# EasyEDA Pro project CogletESP_2026-02-24.epro, board Proto-Coglet
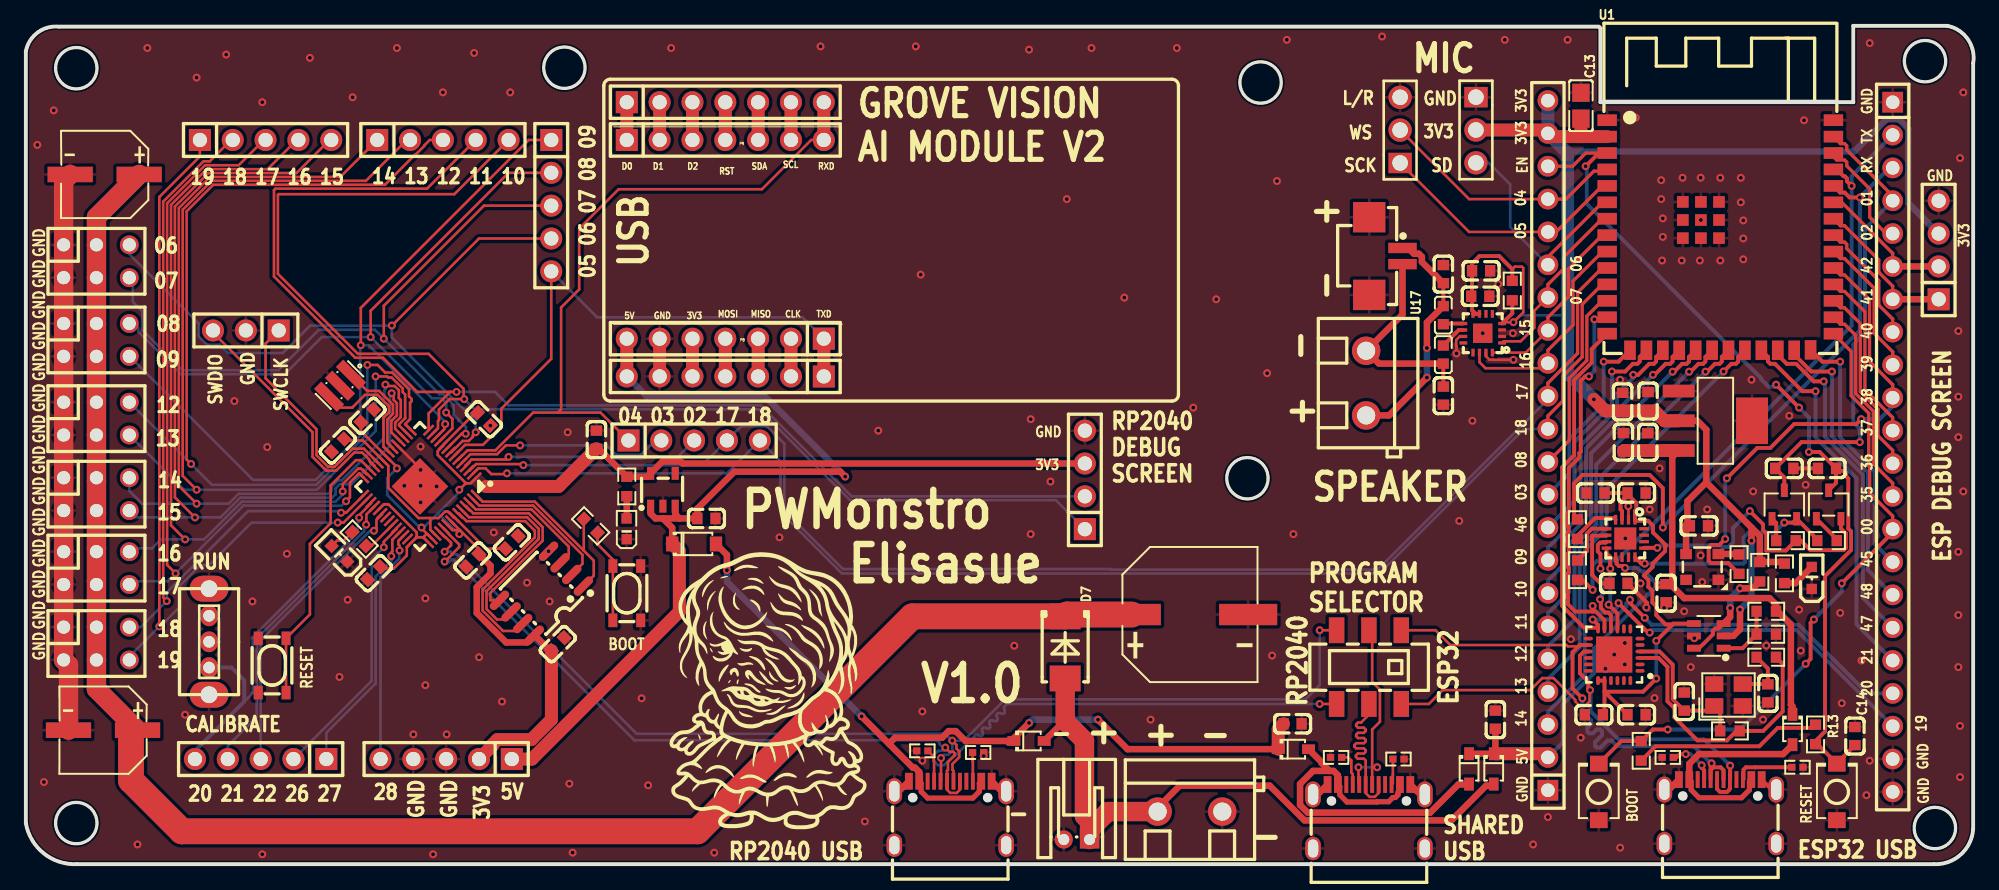
[diagram p5: board, top side]
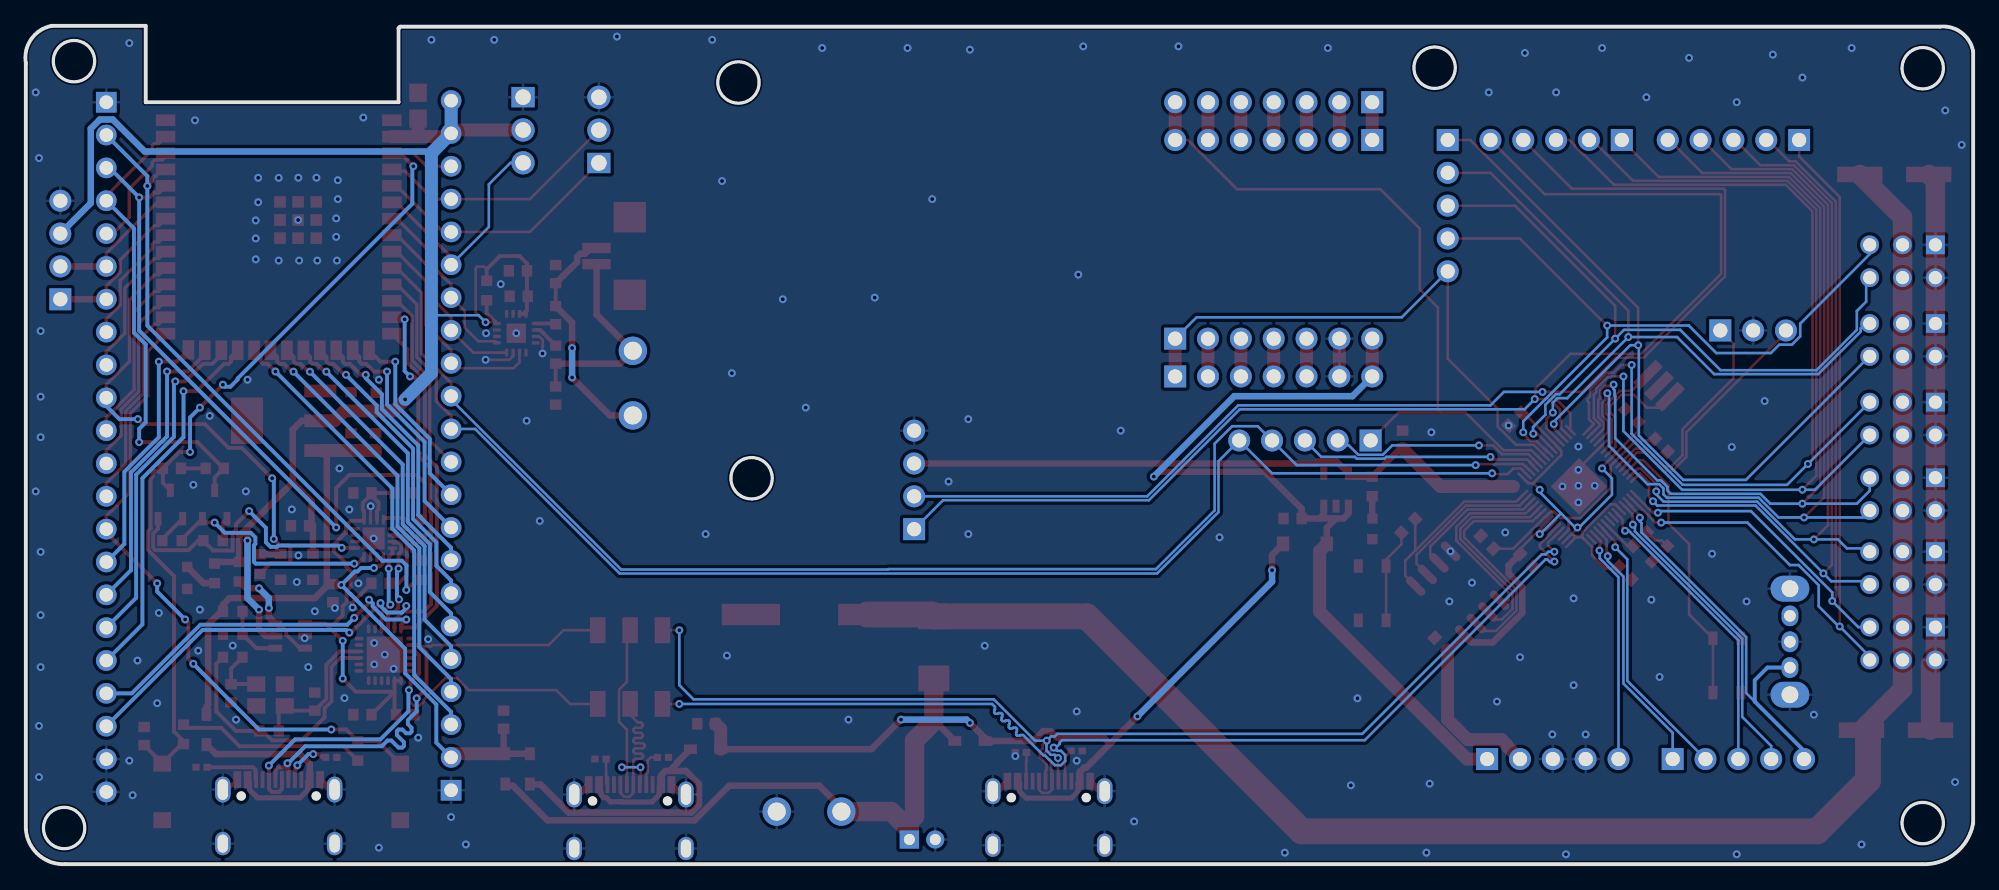
[diagram p6: board, bottom side, seen from below]

Outline 150.62 x 64.83 mm; copper layers: Top Layer, Bottom Layer. Coordinates in mm from the lower left corner of the outline.
Outline path: circle c3.9,61.56 r1.6 ; circle c3.9,3.17 r1.6 ; circle c41.66,61.59 r1.6 ; circle c94.49,29.84 r1.6 ; circle c95.5,60.45 r1.6 ; circle c146.9,62.1 r1.6 ; circle c147.66,2.79 r1.6 ; 0,62.86 0,3.17 arc(1.37,0.85) 3.94,0 147.57,0 arc(149.66,0.74) 150.62,2.72 150.62,61.94 arc(150.21,63.79) 148.62,64.83 141.35,64.83 141.35,58.93 121.79,58.93 121.79,64.64 121.67,64.77 2.58,64.77 arc(0.92,64.32) 0,62.86
Stack: Top Layer 0.035mm / Dielectric1 1.51mm FR4 er 4.5 / Bottom Layer 0.035mm

## Design rules (mm)
net USB_DM: DP1
net USB_DP: DP1
net D_N: DP3
net D_P: DP3
net DNIN: DP2
net DPIN: DP2
template: JLCPCB Capability(Two Layers Board)
spacing copperThickness1oz (default): track to track 0.102, other pairs 0.152 to 0.3
spacing copperThickness2oz: track to track 0.203, other pairs 0.152 to 0.3
track width copperThickness1oz (default): min 0.127, default 0.254, max 2.54
track width copperThickness2oz: min 0.203, default 0.254, max 2.54
differential pair differentialPair (default): width min 0.127, default 0.254, max 2.54; gap min 0.152, default 0.152
via viaSize (default): diameter min 0.5, default 0.61, max 10; hole min 0.3, default 0.305, max 6.3

## Placement (name value [footprint] x y rotation side)
C1  1uF  [C0603]  52.64 26.73 180 top
C2  10uF  [C0603]  113.67 11.18 270 top
C3  220uF  [CAP-SMD_BD6.3-L6.6-W6.6-FD]  5.97 10.36 180 top
C4  1uF  [C0603]  26.42 34.67 225 top
C5  1uF  [C0603]  24.13 32.38 45 top
C6  100nF  [C0603]  26.92 22.5 45 top
C7  100nF  [C0603]  34.54 23.49 45 top
C8  100nF  [C0603]  35.43 34.42 135 top
C9  100nF  [C0603]  37.59 24.89 225 top
C10  10uF  [C0603]  97.98 10.86 180 top
C11  1uF  [C0603]  44.13 32.83 270 top
C12  1uF  [C0603]  41.15 17.02 225 top
C13  10uF  [C0805]  120.28 58.66 270 top
C14  1uF  [C0603]  141.48 9.91 270 top
C15  1000uF  [CAP-SMD_BD10.0-L10.3-W10.3-FD]  90.04 19.3 0 top
C16  1uF  [C0603]  121.28 11.56 0 top
C17  1uF  [C0603]  124.59 11.56 180 top
C18  15pF  [C0603]  128.27 12.57 90 top
C19  15pF  [C0603]  134.75 13.21 270 top
C20  100nF  [C0603]  129.42 26.16 180 top
C21  220uF  [CAP-SMD_BD6.3-L6.6-W6.6-FD]  6.1 53.34 180 top
C22  100nF  [C0603]  124.59 28.7 0 top
C23  100nF  [C0603]  121.41 28.7 0 top
C24  100nF  [C0603]  123.19 21.72 180 top
C25  4.7uF  [C0603]  139.32 30.61 0 top
C26  1uF  [C0603]  136.02 30.61 180 top
C27  100nF  [C0603]  123.57 32.64 270 top
C30  100nF  [C0603]  123.51 35.75 270 top
C32  10uF  [C0603]  125.46 32.62 270 top
C33  10uF  [C0603]  125.48 35.81 270 top
C34  10uF  [C0603]  126.87 20.95 90 top
C35  10uF  [C0603]  112.5 43.92 180 top
C36  100nF  [C0603]  112.56 45.89 180 top
C37  220pF  [C0603]  109.64 36.23 90 top
C38  220pF  [C0603]  109.64 45.63 270 top
CN1  HC-1.25-2PWT  [CONN-SMD_2P-P1.25-HC-1.25-2PWT]  105.2 47.03 270 top
D1  DSK34  [SOD-123_L2.8-W1.8-LS3.7-RD]  51.69 24.76 0 top
D2  B5819WS  [SOD-323_L1.8-W1.3-LS2.5-RD]  113.54 7.37 270 top
D3  B5819WS  [SOD-323_L1.8-W1.3-LS2.5-RD]  136.65 10.41 270 top
D4  B5819WS  [SOD-323_L1.8-W1.3-LS2.5-RD]  98.04 8.89 0 top
D5  B5819WS  [SOD-323_L1.8-W1.3-LS2.5-RD]  111.63 7.37 270 top
D6  B5819WS  [SOD-323_L1.8-W1.3-LS2.5-RD]  77.6 9.53 0 top
D7  SS1045-SMB  [SMB_L4.4-W3.6-LS5.3-RD]  80.39 16.76 270 top
H1  PZ254V-11-05P  [HDR-TH_5P-P2.54-V-M]  32.51 8.13 180 top
H7  X6511WV-03H-C60D30  [HDR-TH_3P-P2.54-V-M]  17.02 41.27 180 top
H8  PZ254V-11-04P  [HDR-TH_4P-P2.54-V-M]  147.95 47.5 90 top
H9  PZ254V-11-04P  [HDR-TH_4P-P2.54-V-M]  81.92 29.72 90 top
H11  2.54-1*3P针  [HDR-TH_3P-P2.54-V-M-1]  106.3 56.77 90 top
H12  2.54-1*3P针  [HDR-TH_3P-P2.54-V-M-1]  112.16 56.78 270 top
H13  PZ254V-11-05P  [HDR-TH_5P-P2.54-V-M]  51.69 32.77 0 top
H14  PZ254V-11-05P  [HDR-TH_5P-P2.54-V-M]  40.64 50.93 270 top
H15  PZ254V-11-05P  [HDR-TH_5P-P2.54-V-M]  32.26 56.01 0 top
H16  PZ254V-11-05P  [HDR-TH_5P-P2.54-V-M]  18.54 56.01 0 top
H17  PZ254V-11-05P  [HDR-TH_5P-P2.54-V-M]  18.16 8.13 180 top
L1  BLM18PG121SN1D  [L0603]  109.64 42.46 270 top
L2  BLM18PG121SN1D  [L0603]  109.64 39.41 90 top
LED1  SML-D12P8WT86  [LED0603-RD_GREEN]  46.47 25.93 90 top
LED2  SML-D12D8WT86  [LED0603-R-RD_AMBER]  24.26 24 135 top
LED3  SML-D12D8WT86  [LED0603-R-RD_AMBER]  138.14 22.14 90 top
Q1  FDC6333C  [SOT-23-6_L2.9-W1.6-P0.95-LS2.8-BL]  130.18 17.65 90 top
Q2  S8050  [SOT-23-3_L3.0-W1.7-P0.95-LS2.9-BR]  136.02 27.81 270 top
Q3  S8050  [SOT-23-3_L3.0-W1.7-P0.95-LS2.9-BR]  139.45 27.81 270 top
R7  1kΩ  [R0603]  25.78 25.15 315 top
R8  1kΩ  [R0603]  46.48 29.21 90 top
R9  1kΩ  [R0603]  43.69 26.16 135 top
R11  5.1kΩ  [R0402]  69.34 8.76 0 top
R12  5.1kΩ  [R0402]  73.66 8.64 180 top
R13  10kΩ  [R0603]  138.43 10.03 90 top
R14  10kΩ  [R0603]  124.95 8.76 270 top
R15  100kΩ  [R0603]  134.62 19.56 180 top
R16  100kΩ  [R0603]  134.62 17.78 0 top
R17  100kΩ  [R0603]  134.12 22.61 270 top
R18  1kΩ  [R0603]  134.62 16 0 top
R19  1kΩ  [R0603]  131.81 10.3 180 top
R20  0Ω  [R0603]  132.52 23.2 90 top
R21  10kΩ  [R0603]  136.03 22.49 90 top
R22  0Ω  [R0603]  120.02 25.91 270 top
R23  0Ω  [R0603]  120.02 22.73 90 top
R24  12kΩ  [R0603]  139.32 25.02 180 top
R25  12kΩ  [R0603]  136.14 25.02 0 top
R26  5.1kΩ  [R0402]  127 8.25 0 top
R27  5.1kΩ  [R0402]  137.03 7.49 180 top
R28  1MΩ  [R0603]  114.98 44.36 90 top
R29  5.1kΩ  [R0402]  101.35 8.25 0 top
R30  5.1kΩ  [R0402]  106.17 8.13 180 top
SW1  SKRPACE010  [KEY-SMD_4P-L4.2-W3.2-P2.20-LS4.6]  46.48 20.95 90 top
SW2  SKRPACE010  [KEY-SMD_4P-L4.2-W3.2-P2.20-LS4.6]  19.05 15.37 270 top
SW3  TS-1088-AR02016  [SW-SMD_L3.9-W3.0-P4.45]  140.08 5.59 90 top
SW4  TS-1088-AR02016  [SW-SMD_L3.9-W3.0-P4.45]  121.67 5.59 90 top
SW5  MST22D18G2 125  [SW-SMD_MST22D18G2]  103.89 15.24 180 top
SW8  SS-12D02-VG4  [SW-TH_SS-12D02-VG4]  14.17 17.2 90 top
U1  ESP32-S3-WROOM-1-N16R8  [WIRELM-SMD_ESP32-S3-WROOM-1]  131.06 48.64 0 top
U2  HX PZ2.54-3x2P ZZ  [HDR-TH_6P-P2.54-V-M-R3-C2-S2.54_2]  5.46 40.54 270 top
U3  S2B-PH-K-S(LF)(SN)  [CONN-TH_S2B-PH-K-S-LF-SN]  81.28 1.91 0 top
U4  HX PZ2.54-3x2P ZZ  [HDR-TH_6P-P2.54-V-M-R3-C2-S2.54_2]  5.46 28.62 270 top
U5  HX PZ2.54-3x2P ZZ  [HDR-TH_6P-P2.54-V-M-R3-C2-S2.54_2]  5.46 34.46 270 top
U6  W25Q16JVSNIQ  [SOP-8_L4.9-W3.9-P1.27-LS6.0-BL]  39.88 20.95 135 top
U7  RP2040  [LQFN-56_L7.0-W7.0-P0.4-EP]  30.48 29.21 225 top
U8  MIC5504-3.3YM5-TR  [SOT-23-5_L3.0-W1.7-P0.95-LS2.8-TL]  49.28 28.96 90 top
U9  DS1021-1x22SF11-B  [HDR-TH_22P-P2.54-V-M]  144.4 32.26 270 top
U10  DS1021-1x22SF11-B  [HDR-TH_22P-P2.54-V-M]  117.73 32.38 90 top
U11  CH334F  [QFN-24_L4.0-W4.0-P0.50-BL-EP2.8]  122.86 16.2 90 top
U12  12MHz  [CRYSTAL-SMD_4P-L3.2-W2.5-BL]  131.7 13.08 0 top
U13  XL-3030RGBC-2812B  [LED-SMD_4P-L3.0-W3.0-P2.00-LS3.1_YKL-3030AY0203Z-001]  129.67 22.99 0 top
U14  CH343P  [TQFN-16_L3.0-W3.0-P0.50-BL-EP1.7]  123.72 25.19 180 top
U15  AMS1117-3.3  [SOT-223-4_L6.5-W3.5-P2.30-LS7.0-BR]  130.68 34.29 180 top
U16  MAX98357AETE+T  [TQFN-16_L3.0-W3.0-P0.50-BL-EP1.5]  112.69 41.06 90 top
U17  KF301-5.0-2P  [CONN-TH_P5.00_KF301-5.0-2P]  103.67 37.2 270 top
U18  HB-PH3-25417PB2GOP  [HDR-TH_7P-P2.54-V-M]  54.1 56.01 0 top
U19  HB-PH3-25417PB2GOP  [HDR-TH_7P-P2.54-V-M]  54.1 37.72 180 top
U20  HB-PH3-25417PB2GOP  [HDR-TH_7P-P2.54-V-M]  54.1 40.64 180 top
U21  HB-PH3-25417PB2GOP  [HDR-TH_7P-P2.54-V-M]  54.1 58.93 0 top
U22  HX PZ2.54-3x2P ZZ  [HDR-TH_6P-P2.54-V-M-R3-C2-S2.54_2]  5.46 46.63 270 top
U23  HX PZ2.54-3x2P ZZ  [HDR-TH_6P-P2.54-V-M-R3-C2-S2.54_2]  5.46 17.06 270 top
U24  HX PZ2.54-3x2P ZZ  [HDR-TH_6P-P2.54-V-M-R3-C2-S2.54_2]  5.46 22.9 270 top
U25  KF301-5.0-2P  [CONN-TH_P5.00_KF301-5.0-2P]  90.04 4.06 0 top
USBC1  TYPE-C-31-M-12  [USB-C_SMD-TYPE-C-31-M-12_1]  71.5 3.94 0 top
USBC2  TYPE-C-31-M-12  [USB-C_SMD-TYPE-C-31-M-12_1]  131.06 4.06 0 top
USBC3  TYPE-C-31-M-12  [USB-C_SMD-TYPE-C-31-M-12_1]  103.89 3.68 0 top
X1  12MHz  [CRYSTAL-SMD_3P-L3.2-W1.3-P1.2-BL]  24.3 37 225 top

## Footprints (pads in the part's own frame, mm; a bottom-side part is the same pattern mirrored in y, then rotated)
C0603
  rect 0.8x0.9 smd: 1(-0.7,0) 2(0.7,0)
C0805
  rect 1.41x1.35 smd: 1(-1,0) 2(1,0)
CAP-SMD_BD6.3-L6.6-W6.6-FD
  rect 3.5x1.2 smd: 1(-2.67,0) 2(2.67,0)
CAP-SMD_BD10.0-L10.3-W10.3-FD
  rect 4.5x1.65 smd: 1(-4.5,0) 2(4.5,0)
CONN-SMD_2P-P1.25-HC-1.25-2PWT
  rect 0.8x2.2 smd: 1(-0.625,1.285) 2(0.625,1.285)
  rect 2.35x2.5 smd: 3(-3.005,-1.285) 4(3.005,-1.285)
CONN-TH_P5.00_KF301-5.0-2P
  round 2.2 hole 1.4: 1(-2.5,0) 2(2.5,0)
CONN-TH_S2B-PH-K-S-LF-SN
  rect 1.5x1.4 hole 0.85: 1(1,0)
  round 1.4 hole 0.85: 2(-1,0)
CRYSTAL-SMD_3P-L3.2-W1.3-P1.2-BL
  rect 0.8x2.5 smd: 1(-1.2,0) 2(0,0) 3(1.2,0)
CRYSTAL-SMD_4P-L3.2-W2.5-BL
  rect 1.4x1.2 smd: 1(-1.1,-0.85) 2(1.1,-0.85) 3(1.1,0.85) 4(-1.1,0.85)
HDR-TH_3P-P2.54-V-M
  rect 1.7x1.7 hole 1.1: 1(-2.54,0)
  round 1.7 hole 1.1: 2(0,0) 3(2.54,0)
HDR-TH_3P-P2.54-V-M-1
  rect 1.575x1.8 hole 1.2: 1(-2.54,0)
  round 1.8 hole 1.2: 2(0,0) 3(2.54,0)
HDR-TH_4P-P2.54-V-M
  rect 1.7x1.7 hole 1.1: 1(-3.81,0)
  round 1.7 hole 1.1: 2(-1.27,0) 3(1.27,0) 4(3.81,0)
HDR-TH_5P-P2.54-V-M
  rect 1.7x1.7 hole 1.1: 1(-5.08,0)
  round 1.7 hole 1.1: 2(-2.54,0) 3(0,0) 4(2.54,0) 5(5.08,0)
HDR-TH_6P-P2.54-V-M-R3-C2-S2.54_2
  round 1.45 hole 1.02: 1(1.27,2.54) 2(-1.27,2.54) 3(-1.27,0) 4(1.27,0) 5(1.27,-2.54)
  rect 1.45x1.45 hole 1.02: 6(-1.27,-2.54)
HDR-TH_7P-P2.54-V-M
  rect 1.7x1.7 hole 1.1: 1(-7.62,0)
  round 1.7 hole 1.1: 2(-5.08,0) 3(-2.54,0) 4(0,0) 5(2.54,0) 6(5.08,0) 7(7.62,0)
HDR-TH_22P-P2.54-V-M
  rect 1.6x1.6 hole 1.05: 1(-26.67,0)
  round 1.6 hole 1.05: 2(-24.13,0) 3(-21.59,0) 4(-19.05,0) 5(-16.51,0) 6(-13.97,0) 7(-11.43,0) 8(-8.89,0) 9(-6.35,0) 10(-3.81,0) 11(-1.27,0) 12(1.27,0) 13(3.81,0) 14(6.35,0) 15(8.89,0) 16(11.43,0) 17(13.97,0) 18(16.51,0) 19(19.05,0) 20(21.59,0) 21(24.13,0) 22(26.67,0)
KEY-SMD_4P-L4.2-W3.2-P2.20-LS4.6
  rect 1.05x0.7 smd: 1(-2.1,1.075) 2(2.1,1.075) 3(-2.1,-1.075) 4(2.1,-1.075)
L0603
  rect 0.8x0.864 smd: 1(-0.7,0) 2(0.7,0)
LED0603-R-RD_AMBER
  rect 0.8x0.8 smd: 1(0.851,0) 2(-0.851,0)
LED0603-RD_GREEN
  rect 0.8x0.8 smd: 1(-0.799,-0.004) 2(0.799,0.004)
LED-SMD_4P-L3.0-W3.0-P2.00-LS3.1_YKL-3030AY0203Z-001
  rect 0.9x0.8 smd: 1(-1.25,1) 2(-1.25,-1) 3(1.25,-1) 4(1.25,1)
LQFN-56_L7.0-W7.0-P0.4-EP
  rect 1.1x0.2 smd: 1(-3.55,2.6) 2(-3.55,2.2) 3(-3.55,1.8) 4(-3.55,1.4) 5(-3.55,1) 6(-3.55,0.6) 7(-3.55,0.2) 8(-3.55,-0.2) 9(-3.55,-0.6) 10(-3.55,-1) 11(-3.55,-1.4) 12(-3.55,-1.8) 13(-3.55,-2.2) 14(-3.55,-2.6) 29(3.55,-2.6) 30(3.55,-2.2) 31(3.55,-1.8) 32(3.55,-1.4) 33(3.55,-1) 34(3.55,-0.6) 35(3.55,-0.2) 36(3.55,0.2) 37(3.55,0.6) 38(3.55,1) 39(3.55,1.4) 40(3.55,1.8) 41(3.55,2.2) 42(3.55,2.6)
  rect 0.2x1.1 smd: 15(-2.6,-3.55) 16(-2.2,-3.55) 17(-1.8,-3.55) 18(-1.4,-3.55) 19(-1,-3.55) 20(-0.6,-3.55) 21(-0.2,-3.55) 22(0.2,-3.55) 23(0.6,-3.55) 24(1,-3.55) 25(1.4,-3.55) 26(1.8,-3.55) 27(2.2,-3.55) 28(2.6,-3.55) 43(2.6,3.55) 44(2.2,3.55) 45(1.8,3.55) 46(1.4,3.55) 47(1,3.55) 48(0.6,3.55) 49(0.2,3.55) 50(-0.2,3.55) 51(-0.6,3.55) 52(-1,3.55) 53(-1.4,3.55) 54(-1.8,3.55) 55(-2.2,3.55) 56(-2.6,3.55)
  rect 3.1x3.1 smd: 57(0,0)
QFN-24_L4.0-W4.0-P0.50-BL-EP2.8
  oval 0.28x0.7 smd: 1(-1.25,-2) 2(-0.75,-2) 3(-0.25,-2) 4(0.25,-2) 5(0.75,-2) 6(1.25,-2) 13(1.25,2) 14(0.75,2) 15(0.25,2) 16(-0.25,2) 17(-0.75,2) 18(-1.25,2)
  oval 0.7x0.28 smd: 7(2,-1.25) 8(2,-0.75) 9(2,-0.25) 10(2,0.25) 11(2,0.75) 12(2,1.25) 19(-2,1.25) 20(-2,0.75) 21(-2,0.25) 22(-2,-0.25) 23(-2,-0.75) 24(-2,-1.25)
  rect 2.8x2.8 smd: 25(0.013,0)
R0402
  rect 0.566x0.54 smd: 1(-0.433,0) 2(0.433,0)
R0603
  rect 0.806x0.864 smd: 1(-0.753,0) 2(0.753,0)
SMB_L4.4-W3.6-LS5.3-RD
  rect 2x2.4 smd: 1(-2.4,0) 2(2.4,0)
SOD-123_L2.8-W1.8-LS3.7-RD
  rect 0.95x1.15 smd: 1(-1.692,0) 2(1.692,0)
SOD-323_L1.8-W1.3-LS2.5-RD
  rect 1x0.75 smd: 1(-1.173,0) 2(1.173,0)
SOP-8_L4.9-W3.9-P1.27-LS6.0-BL
  oval 0.63x1.865 smd: 1(-1.905,-2.683) 2(-0.635,-2.683) 3(0.635,-2.683) 4(1.905,-2.683) 5(1.905,2.683) 6(0.635,2.683) 7(-0.635,2.683) 8(-1.905,2.683)
SOT-23-3_L3.0-W1.7-P0.95-LS2.9-BR
  rect 1.038x0.532 smd: 1(1.101,-0.95) 2(1.101,0.95) 3(-1.101,0)
SOT-23-5_L3.0-W1.7-P0.95-LS2.8-TL
  rect 1x0.55 smd: 1(-1.272,0.95) 2(-1.272,0) 3(-1.272,-0.95) 4(1.272,-0.95) 5(1.272,0.95)
SOT-23-6_L2.9-W1.6-P0.95-LS2.8-BL
  rect 0.532x1.072 smd: 1(-0.95,-1.149) 2(0,-1.149) 3(0.95,-1.149) 4(0.95,1.149) 5(0,1.149) 6(-0.95,1.149)
SOT-223-4_L6.5-W3.5-P2.30-LS7.0-BR
  rect 2.47x0.98 smd: 1(2.835,-2.3) 2(2.835,0) 3(2.835,2.3)
  rect 2.47x3.6 smd: 4(-2.835,0)
SW-SMD_L3.9-W3.0-P4.45
  rect 1.23x1.36 smd: 1(-2.185,0) 2(2.185,0)
SW-SMD_MST22D18G2
  rect 1.2x2 smd: 1(-2.5,2.85) 2(0,2.85) 3(2.5,2.85) 4(-2.5,-2.85) 5(0,-2.85) 6(2.5,-2.85)
SW-TH_SS-12D02-VG4
  oval 1.6x1.3 hole 0.9: 1(-2,0) 2(-0.006,0) 3(2,0)
  oval 2x3 hole 1.3: 4(4.1,0) 5(-4.1,0)
TQFN-16_L3.0-W3.0-P0.50-BL-EP1.5
  rect 0.25x0.6 smd: 1(-0.749,-1.5) 2(-0.248,-1.5) 3(0.252,-1.5) 4(0.751,-1.5) 9(0.75,1.5) 10(0.25,1.5) 11(-0.25,1.5) 12(-0.749,1.5)
  rect 0.6x0.25 smd: 5(1.5,-0.748) 6(1.5,-0.248) 7(1.5,0.252) 8(1.5,0.752) 13(-1.5,0.752) 14(-1.5,0.252) 15(-1.5,-0.248) 16(-1.5,-0.748)
  rect 1.5x1.5 smd: 17(0,0)
TQFN-16_L3.0-W3.0-P0.50-BL-EP1.7
  rect 0.25x0.75 smd: 1(-0.749,-1.45) 2(-0.248,-1.45) 3(0.252,-1.45) 4(0.751,-1.45) 9(0.75,1.45) 10(0.25,1.45) 11(-0.25,1.45) 12(-0.749,1.45)
  rect 0.75x0.25 smd: 5(1.45,-0.75) 6(1.45,-0.25) 7(1.45,0.25) 8(1.45,0.75) 13(-1.45,0.75) 14(-1.45,0.25) 15(-1.45,-0.25) 16(-1.45,-0.75)
  rect 1.7x1.7 smd: 17(0.001,0)
USB-C_SMD-TYPE-C-31-M-12_1
  oval 1.2x2 hole 0.8x1.6: 1(4.325,1.706) 4(-4.325,1.706)
  oval 1.2x1.8 hole 0.8x1.4: 2(4.325,-2.474) 3(-4.325,-2.474)
  custom 0.6x1.3 smd: A1B12(-3.2,2.474) A4B9(-2.4,2.474) B1A12(3.2,2.474) B4A9(2.401,2.474)
  rect 0.3x1.3 smd: A5(-1.25,2.474) A6(-0.25,2.474) A7(0.25,2.474) A8(1.25,2.474) B5(1.75,2.474) B6(0.75,2.474) B7(-0.75,2.474) B8(-1.75,2.474)
WIRELM-SMD_ESP32-S3-WROOM-1
  rect 1.5x0.9 smd: 1(-8.75,8.895) 2(-8.75,7.625) 3(-8.75,6.355) 4(-8.75,5.085) 5(-8.75,3.815) 6(-8.75,2.545) 7(-8.75,1.275) 8(-8.75,0.005) 9(-8.75,-1.265) 10(-8.75,-2.535) 11(-8.75,-3.805) 12(-8.75,-5.075) 13(-8.75,-6.345) 14(-8.75,-7.615) 27(8.75,-7.615) 28(8.75,-6.345) 29(8.75,-5.075) 30(8.75,-3.805) 31(8.75,-2.535) 32(8.75,-1.265) 33(8.75,0.005) 34(8.75,1.275) 35(8.75,2.545) 36(8.75,3.815) 37(8.75,5.085) 38(8.75,6.355) 39(8.75,7.625) 40(8.75,8.895)
  rect 0.9x1.5 smd: 15(-6.985,-8.895) 16(-5.715,-8.895) 17(-4.445,-8.895) 18(-3.175,-8.895) 19(-1.905,-8.895) 20(-0.635,-8.895) 21(0.635,-8.895) 22(1.905,-8.895) 23(3.175,-8.895) 24(4.445,-8.895) 25(5.715,-8.895) 26(6.985,-8.865)
  rect 0.9x0.9 smd: 41(-2.9,2.575) 41(-2.9,1.175) 41(-2.9,-0.225) 41(-1.5,2.575) 41(-1.5,1.175) 41(-1.5,-0.225) 41(-0.1,2.575) 41(-0.1,1.175) 41(-0.1,-0.225)

## Nets
As in the schematic.

Pads without a net: SW8 3; U7 35 36 41; U8 4; U11 1 2 5 6 7 8 13 16 17 18 21 22 23 24; U13 2; U14 10 11 14 15 16; U16 5 6 12 13; USBC1 A8 B8; USBC2 A8 B8; USBC3 A8 B8

## Via types
v1: diameter 0.61, hole 0.305, Top Layer to Bottom Layer, 267 vias

## Routing (per net, layer and track width the routed paths; a pad name or vN(x,y) marks a point on that pad's centre or on a via; arc(x,y) is an arc through that point)
1V1: length 18.6
  Top Layer w0.2: 31.29,26.77 30.38,26.77 28.04,29.11 28.04,30.81 U7.23 26.08,32.77 24.87,32.77 ; 31.29,26.77 31.92,26.77 32.43,27.27 32.63,27.27 33.06,26.84 33.13,26.84 35.58,24.4 C9.2 ; 31.29,26.76 31.29,25.86 U7.45
3V3: length 117.3
  Top Layer w0.2: U7.44 31.05,25.53 ; 31.05,25.53 30.61,25.97 v1(30.61,26.03) ; 31.05,25.53 30.99,25.53 30.74,25.28 30.74,25.27 ; U7.48 33,25.84 33.57,25.84 ; U7.1 34.4,29.45 34.12,29.45 ; 33.57,25.84 33.53,25.79 v1(33.53,25.53) ; 33.57,25.84 U7.49 ; 33.57,25.84 35.04,24.37 C7.2 ; 30.74,25.27 31.15,24.86 ; 30.74,25.27 30.22,25.27 ; C6.2 27.56,22.86 28.45,22.86 29.46,23.88 29.46,24.52 U7.42 30.22,25.27 ; 34.12,29.45 34.02,29.45 v1(33.53,28.96) ; 34.12,29.45 34.11,29.46 34.04,29.46 31.85,31.65 31.85,31.93 32.28,32.36 U7.10 34.77,34.91 34.94,34.91 ; 30.22,25.27 30.22,25.34 30.24,25.36 30.24,25.57 30.22,25.58 30.22,25.66 28.07,27.81 27.99,27.81 27.97,27.84 27.76,27.84 27.74,27.81 27.67,27.81 U7.33 ; v1(28.7,30.61) 28.7,30.71 U7.22 25.92,33.49 C4.2
  Top Layer w0.5: H9.3 50.81,30.99 50.67,31.13 49.23,31.13 U8.5 48.06,29.96 R8.2 44.31,32.13 C11.2 ; 40.65,16.52 40.52,16.52 39.33,17.71 38.76,17.14 37.15,17.14 34.88,19.42 34.88,21.42 35.94,22.48 35.94,23.09 C7.2
  Top Layer w1: 40.65,16.52 40.65,11.19 39.09,9.63 36.47,9.63 36.09,9.25 36.09,9.17 H1.2 ; C11.2 41.21,29.21 35.56,29.21
  Bottom Layer w0.2: v1(33.53,28.96) 33.53,28.78 31.88,27.13 ; 31.88,27.13 30.78,26.03 v1(30.61,26.03) 30.48,26.03 27.94,28.57 27.94,29.84 v1(28.7,30.61) ; 31.88,27.13 33.49,25.53 v1(33.53,25.53)
3V3_OP: length 34.2
  Top Layer w0.3: 127.31,18.48 127.25,18.54 126.82,18.54 126.11,19.26 126.11,19.94 125.81,20.24 125.81,21.13 125.49,21.45 125.5,21.47 125.5,21.97 125.15,22.32 125.16,22.32 125.83,22.99 125.83,23.24 126.8,24.21 126.8,24.62 126.85,24.66 125.86,25.65 125.86,26.18 125.48,26.55 124.55,26.55 U14.1 124.46,27.31 124.57,27.41 124.57,27.83 124.56,27.84 124.56,27.94 124.08,28.42 123.98,28.42 123.92,28.37 ; 127.31,18.48 127.44,18.6 Q1.4 ; 127.31,18.48 v1(126.11,17.27) ; U11.19 U11.20 122.11,13.34 ; 123.89,28.46 123.39,28.04 123.39,27.98 123.34,27.94 123.34,27.43 123.46,27.32 U14.3 ; 122.11,13.34 122.11,11.68 C16.2 ; 122.11,13.34 125.1,13.34 v1(126.11,14.35) ; 122.11,13.34 C17.2 ; 122.11,28.7 C22.1
  Bottom Layer w0.3: v1(126.11,14.35) v1(126.11,17.27)
GND: length 67.3
  Top Layer w0.2: U14.2 123.96,27.67 v1(123.95,27.69) ; v1(115.06,39) 113.49,39 113.49,39.01 113.21,39.01 112.94,39.28 U16.15 ; U16.11 110.91,40.81 110.64,40.54 110.64,40.08 110.66,40.06 v1(110.66,39.5) ; U7.19 30.53,30.57 v1(30.53,30.49)
  Top Layer w0.3: v1(125.34,19.85) 125.34,20.13 125.41,20.2 C24.1 ; USBC2.B1A12 135.03,5.77 USBC2.1 ; C26.1 C25.1
  Top Layer w0.5: USBC2.A1B12 127.1,5.77 USBC2.4 ; USBC3.4 99.92,5.39 100.69,6.16 ; USBC1.A1B12 67.53,5.64 USBC1.4 ; USBC3.1 107.85,5.39 USBC3.B1A12 ; USBC1.B1A12 75.47,5.64 USBC1.1
  Top Layer w1: U19.6 U20.6
  Top Layer w1.5: C21.2 2.92,52.83 U22.6 U22.5 U2.6 U2.5 U5.6 U5.5 U23.6 U23.5 3.3,15.41 C3.2
  vias: v1(0.89,55.63) v1(1.4,6.35) v1(2.16,58.29) v1(8.64,1.52) v1(9.4,63.12) v1(12.32,11.56) v1(13.21,60.83) v1(15.49,62.61) v1(16.13,35.81) v1(17.53,20.32) v1(18.29,58.93) v1(18.29,0.76) v1(18.67,32.26) v1(20.19,24) v1(21.97,62.36) v1(24.26,14.48) v1(24.89,20.45) v1(25.27,59.31) v1(28.7,63.12) v1(29.27,29.26) v1(29.97,10.03) v1(30.53,32.29) v1(30.53,29.26) v1(30.53,27.98) v1(30.9,20.56) v1(30.9,13.84) v1(31.5,0.76) v1(31.77,29.21) v1(32.26,59.69) v1(32.55,10.03) v1(34.67,62.74) v1(35.05,16) v1(35.93,33.92) v1(36.19,25.65) v1(36.83,12.57) v1(37.46,59.69) v1(38.77,21.77) v1(40.43,24.2) v1(40.51,20.32) v1(41.91,33.4) v1(42.04,6.22) v1(42.29,0.89) v1(47.62,12.83) v1(48.13,6.1) v1(49.91,63.12) v1(53.24,0.89) v1(58.29,25.27) v1(61.47,63.25) v1(64.9,3.3) v1(65.93,33.53) v1(68.83,63.25) v1(69.21,45.59) v1(69.34,11.81) v1(69.34,8) v1(74.09,8.36) v1(76.45,16.89) v1(77.6,62.99) v1(77.72,34.41) v1(77.72,25.53) v1(79.25,29.59) v1(80.52,51.43) v1(82.42,63.12) v1(84.96,43.81) v1(86.99,11.18) v1(89.03,63.12) v1(90.3,35.31) v1(92.08,43.69) v1(96.01,37.97) v1(96.39,16.13) v1(96.77,52.83) v1(97.54,63.75) v1(98.04,25.53) v1(104.9,64.01) v1(110.87,26.54) v1(111.89,34.29) v1(112.69,41.06) v1(113.89,44.86) v1(114.39,63.75) v1(115.03,41.06) v1(116.59,1.52) v1(117.73,3.64) v1(119.25,63.75) v1(119.51,17.4) v1(120.27,9.78) v1(122.17,15.11) v1(122.86,16.21) v1(123.32,37.46) v1(123.32,1.27) v1(123.72,25.19) v1(123.68,17.1) v1(123.68,15.45) v1(124.52,57.74) v1(124.9,21.72) v1(125.6,27.43) v1(125.98,12.84) v1(126.36,30.61) v1(126.49,52.9) v1(126.49,51.43) v1(126.62,49.94) v1(126.62,48.51) v1(126.56,46.68) v1(126.72,19.81) v1(128.14,53.09) v1(128.08,46.68) v1(128.27,19.56) v1(128.78,15.24) v1(129.06,17.48) v1(129.55,53.09) v1(129.48,46.68) v1(129.54,23.88) v1(129.56,49.82) v1(129.66,21.82) v1(130.05,27.43) v1(131.06,53.08) v1(131.06,46.68) v1(132.65,53.08) v1(132.65,51.19) v1(132.84,49.78) v1(132.84,48.39) v1(132.84,46.78) v1(133.48,37.46) v1(133.6,28.83) v1(134.37,11.18) v1(134.62,16.9) v1(136.4,34.67) v1(137.16,19.68) v1(137.29,16.51) v1(137.54,57.53) v1(137.67,29.34) v1(140.33,19.43) v1(140.46,12.45) v1(141.99,15.75) v1(142.37,5.33) v1(142.62,63.5) v1(142.62,8) v1(149.48,41.23) v1(149.48,36.15) v1(149.48,33.02) v1(149.48,24.15) v1(149.48,19.26) v1(149.48,15.24) v1(149.61,54.61) v1(149.61,10.69) v1(149.61,6.73) v1(149.86,59.69) v1(149.86,28.83)
VBUS: length 66.4
  Top Layer w0.4: USBC1.A4B9 69.25,6.26 69.25,5.62 69.76,5.11 73.24,5.11 73.75,5.62 73.75,6.26 USBC1.B4A9
  Top Layer w0.5: 66.76,9.31 68.61,7.46 68.77,7.46 69.1,7.13 USBC1.A4B9 ; 66.76,9.31 v1(64.64,11.43) ; 66.76,9.31 67.23,9.78 70.87,9.78 71.37,10.29 71.92,10.29 72.68,9.53 75.89,9.53 75.99,9.42 76.32,9.42 D6.1 76.42,9.75 v1(77.6,10.92) ; D1.2 54.23,23.92 v1(54.23,22.73) ; D4.1 85.22,8.89 v1(82.93,11.18)
  Top Layer w1: C10.2 96.87,10.45 D4.1
  Bottom Layer w0.5: v1(77.6,10.92) 77.85,11.18 v1(82.93,11.18) ; v1(64.64,11.43) 54.23,21.84 v1(54.23,22.73)
VBUSINESP: length 62.8
  Top Layer w0.3: U14.9 122.97,23.59 123.04,23.52 123.04,23.24 123.22,23.06 123.54,23.06 v1(123.7,22.91)
  Top Layer w0.5: U15.3 127.35,31.49 127.35,21.5 128.27,20.57 134.87,20.57 135.37,20.07 135.37,19.68 136.52,18.53 136.52,12.32 136.65,12.19 D3.1 ; D5.1 113.41,8.54 113.54,8.41 113.67,8.54 C2.2 ; v1(126.22,21.59) 126.81,21.59 126.87,21.65
  Top Layer w1: U10.2 117.45,8.54 113.67,8.54 ; C27.2 123.62,31.99 U15.3
  Bottom Layer w0.3: U10.2 118.87,9.4 118.87,12.35 121.28,14.76 121.28,16.67 125.48,20.86 125.49,20.86 v1(126.22,21.59) 125.18,22.63 124.97,22.63 124.7,22.91 v1(123.7,22.91)
#EN: length 68.1
  Top Layer w0.254: 121.67,55 120.65,55 119.63,53.97 U10.20
  Top Layer w0.3: 138.44,9.28 138.44,9.53 139.16,10.26 139.16,22.28 141.18,24.3 141.18,25.74 140.97,25.96 140.97,29.82 140.81,29.98 140.81,30.28 140.67,30.41 140.02,30.41 140.02,29.49 Q3.3 ; 138.44,9.28 138.57,9.28 SW3.2 140.08,7.81 C14.2 ; 138.44,9.28 R13.1 ; U1.3 121.67,55 v1(120.65,53.97) ; C25.2 138.75,31.88 v1(137.92,31.88) ; v1(137.16,35.31) v1(135.38,37.08)
  Bottom Layer w0.3: v1(135.38,37.08) 135.22,36.92 134.8,36.92 134.24,37.48 134.24,37.56 120.73,51.07 120.73,53.89 v1(120.65,53.97) ; v1(137.16,35.31) 137.92,34.54 v1(137.92,31.88)
D_N: length 38.5
  Top Layer w0.2: SW5.4 109.04,18.09 110.18,16.95 119.17,16.95 119.28,16.84 120.09,16.84
  Top Layer w0.3: v1(120.4,12.83) 119.63,13.59 119.63,16.38 120.2,16.95 U11.14 ; v1(130.39,7.8) 130.31,7.73 130.31,7.26 ; USBC2.A7 131.31,7.27 131.09,7.49 130.54,7.49 130.31,7.26 ; USBC2.B7 130.31,7.26
  Bottom Layer w0.3: v1(130.39,7.8) 130.33,7.8 129.01,9.12 123.09,9.12 122.65,9.56 122.35,9.56 121.8,9.02 121.5,9.02 121.38,9.14 121.38,9.44 121.92,9.98 121.92,10.28 121.8,10.41 121.5,10.41 121.21,10.12 120.91,10.12 120.79,10.24 120.79,10.54 121.07,10.83 121.07,11.13 120.4,11.81 v1(120.4,12.83)
D_P: length 38.4
  Top Layer w0.2: SW5.1 108.53,12.39 109.6,13.46 116.37,13.46 117.29,14.39 118.17,14.39 119.84,12.71 119.84,12.6 120.17,12.27 120.63,12.27 120.95,12.6 120.95,13.42 v1(120.99,13.46)
  Top Layer w0.3: v1(131.83,7.62) 131.83,6.55 USBC2.B6 ; U11.15 120.52,16.45 120.21,16.13 120.21,14.76 120.86,14.11 120.86,13.6 v1(120.99,13.46) ; 131.83,5.84 131.77,5.78 131.77,5.76 131.59,5.59 131.04,5.59 130.81,5.81 USBC2.A6
  Bottom Layer w0.3: v1(131.83,7.62) 129.79,9.65 123.2,9.65 121.03,11.82 121.03,13.42 v1(120.99,13.46)
DNIN: length 15.7
  Top Layer w0.2: 104.14,7.51 104.16,7.49 v1(104.52,7.49) ; 104.14,7.51 USBC3.A7 ; 104.14,7.51 104.14,10.41 104.74,11.01 104.74,13.49 104.14,14.1 104.14,17.59 103.89,17.84 SW5.5 ; USBC3.B7 103.08,6.21 v1(103.08,7.49)
  Bottom Layer w0.2: v1(103.08,7.49) v1(104.52,7.49)
DPIN: length 13.7
  Top Layer w0.2: SW5.2 103.89,11.56 103.28,10.95 103.04,10.95 102.9,10.81 102.9,10.69 103.04,10.55 103.49,10.55 103.64,10.41 103.64,10.29 103.49,10.15 103.04,10.15 102.9,10.01 102.9,9.89 103.04,9.75 103.49,9.75 103.64,9.61 103.64,9.49 103.49,9.35 102.9,9.35 102.76,9.21 102.76,9.09 102.9,8.95 103.49,8.95 103.64,8.81 103.64,8.69 103.49,8.55 103.02,8.55 102.88,8.41 102.88,8.29 103.02,8.15 103.49,8.15 103.64,8.01 USBC3.A6 103.64,5.5 103.93,5.21 104.34,5.21 104.65,5.51 104.65,6.14 USBC3.B6
DTR: length 17.8
  Top Layer w0.3: v1(136.02,26.42) 136.67,26.42 Q2.2 138.57,25.11 R24.2 ; v1(125.22,23.24) 124.96,23.24 U14.12
  Bottom Layer w0.3: v1(125.22,23.24) 132.84,23.24 132.98,23.37 132.98,24.66 132.87,24.77 132.87,25.27 133.23,25.63 135.23,25.63 v1(136.02,26.42)
EIO0: length 49.4
  Top Layer w0.254: U9.14 144.4,26.92 142.62,28.7 142.62,30.74 142.54,30.81 142.54,34.87 141.18,36.23 141.18,39.66 U1.27
  Top Layer w0.3: SW4.2 123.41,9.52 R14.1 125.85,10.41 v1(127,10.41) ; v1(140.46,21.72) 144.4,25.65 U9.14 ; v1(137.67,15.49) 138.05,15.87 138.05,18.67 v1(138.3,18.92)
  Bottom Layer w0.3: v1(138.3,18.92) 140.46,21.08 v1(140.46,21.72) ; v1(127,10.41) 132.59,10.41 v1(137.67,15.49)
EIO1: length 36.6
  Top Layer w0.254: U1.39 140.36,55.72 140.68,55.72 140.84,55.56 140.84,55.24 144.4,51.68 U9.4
  Top Layer w0.3: v1(141.86,32.64) 137.35,32.64 C26.2 136.02,29.91 Q2.3
  Bottom Layer w0.3: U9.4 142.26,49.17 142.26,41.11 141.35,40.2 141.35,34.17 141.86,33.66 v1(141.86,32.64)
EIO2: length 8.8
  Top Layer w0.254: U1.38 139.81,54.71 140.07,54.45 140.68,54.45 140.84,54.29 140.84,54 142.62,52.23 142.62,50.04 143.89,48.77 U9.5
EIO3: length 14.5
  Top Layer w0.3: U1.15 123.2,38.86 v1(122.05,38.86)
  Bottom Layer w0.3: v1(122.05,38.86) 122.05,35.56 119.38,32.89 119.38,30.23 U10.10
EIO4: length 19.2
  Top Layer w0.2: H11.2 111.63,51.43 U10.19
  Top Layer w0.254: U10.19 119.13,51.43 121.28,53.59 122.18,53.59 U1.4
EIO5: length 19.7
  Top Layer w0.2: U10.18 111.63,48.89 106.3,54.23
  Top Layer w0.254: U10.18 118.36,48.89 121.79,52.32 122.18,52.32 U1.5
EIO6: length 17.7
  Top Layer w0.254: U10.17 117.73,46.96 121.95,51.19 U1.6
  Bottom Layer w0.2: H12.3 113.15,54.24 114.81,52.58 114.81,49.28 U10.17
EIO7: length 14
  Top Layer w0.2: U10.16 117.69,43.81 116.68,42.8 116.68,41.49 115.62,40.43 114.31,40.43 U16.1
  Top Layer w0.254: U10.16 117.73,44.83 118.96,46.06 118.96,46.95 121.92,49.92 U1.7
EIO8: length 14.6
  Top Layer w0.254: U10.11 119.38,32.77 119.38,37.59 120.74,38.95 120.74,42.38 121.92,43.56 122.31,43.56 U1.12
EIO9: length 20.4
  Top Layer w0.3: v1(124.33,37.85) 124.72,37.85 125.57,38.69 125.92,38.69 126.1,38.87 126.1,39.23 U1.17
  Bottom Layer w0.3: v1(124.33,37.85) 124.33,37.59 123.08,36.34 123.08,35.2 120.27,32.38 120.27,27.02 117.73,24.48 U10.8
EIO10: length 23.3
  Top Layer w0.3: U1.18 127.37,39.23 127.37,38.87 127.19,38.69 126.84,38.69 125.99,37.85 v1(125.86,37.85)
  Bottom Layer w0.3: U10.7 117.73,21.94 118.87,23.08 118.87,24.89 120.67,26.69 120.67,32.15 123.49,34.97 123.49,35.47 v1(125.86,37.85)
EIO11: length 26.3
  Top Layer w0.3: U1.19 128.64,39.23 128.64,38.87 128.46,38.69 128.11,38.69 127.5,38.09 v1(127.38,38.09)
  Bottom Layer w0.3: v1(127.38,38.09) 121.07,31.78 121.07,26.46 119.38,24.76 119.38,21.05 117.73,19.4 U10.6
EIO12: length 29.4
  Top Layer w0.3: U1.20 129.91,39.23 129.91,38.87 129.73,38.69 129.38,38.69 128.77,38.09 v1(128.65,38.09)
  Bottom Layer w0.3: v1(128.65,38.09) 121.48,30.91 121.48,26.29 119.78,24.6 119.78,18.91 117.73,16.86 U10.5
EIO13: length 32.5
  Top Layer w0.3: v1(129.92,38.09) 130.04,38.09 130.65,38.69 131,38.69 131.18,38.87 131.18,39.23 U1.21
  Bottom Layer w0.3: U10.4 117.73,14.32 120.18,16.77 120.18,24.43 121.88,26.12 121.88,30.04 v1(129.92,38.09)
EIO14: length 35.5
  Top Layer w0.3: U1.22 132.45,39.23 132.45,38.87 132.27,38.69 131.92,38.69 131.32,38.1 v1(131.32,38.1)
  Bottom Layer w0.3: U10.3 117.73,11.78 120.59,14.63 120.59,24.27 122.28,25.96 122.28,29.06 v1(131.32,38.1)
EIO15: length 14.5
  Top Layer w0.2: U10.15 116.02,39.56 U16.16
  Top Layer w0.254: U10.15 117.73,42.29 119.31,43.87 119.31,46.04 121.79,48.51 122.18,48.51 U1.8
EIO16: length 17.1
  Top Layer w0.2: U16.14 112.44,38.82 112.9,38.35 117.35,38.35 U10.14
  Top Layer w0.254: U10.14 117.73,39.75 119.67,41.69 119.67,45.09 121.95,47.38 U1.9
EIO17: length 110.3
  Top Layer w0.2: v1(38.48,30.86) 38.4,30.94 34.82,30.94 34.33,30.45 U7.3
  Top Layer w0.254: U10.13 117.73,37.21 120.03,39.51 120.03,44.21 121.92,46.11 U1.10
  Bottom Layer w0.2: v1(38.48,30.86) 52.32,30.86 H13.4 55.33,33.87 57.32,33.87 58.67,32.51 58.67,27.35 63.21,22.82 83.9,22.82 83.93,22.78 104.57,22.78 117.73,35.94 U10.13
EIO18: length 109.1
  Top Layer w0.2: U7.2 34.99,30.61 35.56,30.61 36,30.16 37.15,30.16 v1(37.21,30.23)
  Top Layer w0.254: U1.11 121.92,44.84 120.38,43.29 120.38,39.23 118.87,37.72 118.87,35.81 117.73,34.67 U10.12
  Bottom Layer w0.2: v1(37.21,30.23) 54.23,30.23 H13.5 58.37,31.16 58.37,27.23 63.12,22.48 104.69,22.48 115.87,33.65 U10.12
EIO19: length 56.8
  Top Layer w0.3: v1(120.9,37.72) 120.61,37.72 120.27,37.38 120.27,31.9 120.16,31.79 120.16,31.45 119.34,30.64 119.34,27.25 119.28,27.19 119.28,26.13 119.34,26.07 119.34,25.75 119.28,25.68 119.28,24.63 119.34,24.56 119.34,24.08 119.28,24.01 119.28,22.96 119.34,22.9 119.34,22.57 119.28,22.51 119.28,20.1 119.84,19.53 121.43,19.53 122.11,18.86 U11.11 ; U1.13 122.15,42.14 v1(121.32,42.14) ; v1(123.19,20.19) 125.48,17.91 v1(125.6,17.91) ; 121.19,19.53 v1(121.19,19.97)
  Bottom Layer w0.3: v1(123.19,20.19) 123.29,20.1 123.29,20.07 122.68,19.46 121.54,19.46 121.19,19.81 v1(121.19,19.97) ; U9.20 136.95,18.11 125.81,18.11 v1(125.6,17.91) ; v1(121.32,42.14) 121.32,38.14 v1(120.9,37.72)
EIO20: length 54
  Top Layer w0.3: 121.61,18.22 121.61,18.5 v1(121.19,18.92) ; 121.61,18.22 121.54,18.29 120.52,18.29 118.83,19.98 118.83,30.69 119.76,31.62 119.76,37.43 121.12,38.79 121.12,39.83 U1.14 ; 121.61,18.22 U11.12 ; v1(124.08,20.45) 124.08,20.19 v1(125.22,19.05)
  Bottom Layer w0.3: v1(124.08,20.45) 123.8,20.16 123.8,19.94 122.77,18.92 v1(121.19,18.92) ; U9.19 142.43,13.21 137.12,18.51 125.76,18.51 v1(125.22,19.05)
EIO21: length 29
  Top Layer w0.3: U1.23 134.76,39.23 134.76,38.87 134.93,38.69 135.29,38.69 137.41,36.58 v1(138.43,36.58)
  Bottom Layer w0.3: v1(138.43,36.58) 138.43,33.02 141.61,29.84 141.61,18.54 U9.18
EIO35: length 15.9
  Top Layer w0.254: U1.28 140.36,41.75 140.68,41.75 141.54,40.89 141.54,36.39 142.9,35.03 142.9,30.96 144.4,29.46 U9.13
EIO36: length 14.7
  Top Layer w0.254: U1.29 140.36,43.02 140.68,43.02 141.9,41.81 141.9,36.54 143.26,35.18 143.26,33.14 144.4,32 U9.12
EIO37: length 13.4
  Top Layer w0.254: U1.30 140.36,44.29 140.68,44.29 142.25,42.72 142.25,36.69 144.4,34.54 U9.11
EIO38: length 38
  Top Layer w0.254: U1.31 140.36,45.56 140.68,45.56 142.61,43.64 142.61,38.87 144.4,37.08 U9.10
  Top Layer w0.3: v1(131.57,29.84) 133.92,32.19 134.93,32.19 136.78,34.04 141.58,34.04 v1(141.96,34.42) ; v1(131.44,25.15) 130.99,24.69 130.34,24.69 130.17,24.51 130.17,23.46 130.34,23.28 131.68,23.28 R20.1
  Bottom Layer w0.3: v1(141.96,34.42) 143.38,34.42 144.4,35.43 U9.10 ; v1(131.57,29.84) 131.44,29.72 v1(131.44,25.15)
EIO39: length 10.9
  Top Layer w0.254: U1.32 140.36,46.83 140.68,46.83 142.96,44.55 142.96,41.06 144.4,39.62 U9.9
EIO40: length 9.6
  Top Layer w0.254: U1.33 140.36,48.1 140.68,48.1 140.84,47.94 140.84,47.62 143.32,45.14 143.32,43.24 144.4,42.16 U9.8
EIO41: length 11.9
  Top Layer w0.254: U1.34 140.36,49.37 140.68,49.37 143.32,46.73 143.32,45.78 144.4,44.7 U9.7
  Top Layer w0.5: U9.7 H8.1
EIO42: length 10.8
  Top Layer w0.254: U9.6 144.4,47.24 140.45,51.19 U1.35
  Top Layer w0.5: U9.6 H8.2
EIO45: length 19.8
  Top Layer w0.3: U1.26 138.96,38.86 v1(140.33,38.86)
  Bottom Layer w0.3: v1(140.33,38.86) 140.33,33.01 143,30.35 143,24.76 U9.15
EIO46: length 17.7
  Top Layer w0.3: v1(122.68,38.1) 123.7,38.1 124.3,38.69 124.65,38.69 124.83,38.87 124.83,39.23 U1.16
  Bottom Layer w0.3: U10.9 119.78,28.09 119.78,32.66 122.68,35.56 v1(122.68,38.1)
EIO47: length 26
  Top Layer w0.3: U1.24 135.51,39.39 136.2,38.69 136.94,38.69 138.29,37.34 v1(139.06,37.34)
  Bottom Layer w0.3: v1(139.06,37.34) 139.17,37.23 139.17,33.04 142.09,30.12 142.09,20.59 U9.17
EIO48: length 23
  Top Layer w0.3: v1(139.7,38.1) 138.1,38.1 136.78,39.42 U1.25
  Bottom Layer w0.3: v1(139.7,38.1) 139.7,33.08 142.49,30.29 142.49,22.73 U9.16
EIORX: length 51.2
  Top Layer w0.3: U1.36 140.33,51.94 140.69,51.94 141.06,51.56 v1(141.86,51.56) ; R22.1 119.76,26.92 119.76,29.46 120.4,30.1 125.6,30.1 126.62,29.08 v1(126.62,26.03)
  Bottom Layer w0.3: U9.3 144.14,53.85 v1(141.86,51.56) 141.86,41.27 v1(126.62,26.03)
EIOTX: length 49.2
  Top Layer w0.3: U1.37 140.08,53.73 140.59,53.21 140.69,53.21 140.87,53.03 140.87,52.81 v1(141.22,52.45) ; v1(121.19,21.21) 120.42,21.98 R23.1
  Bottom Layer w0.3: U9.2 141.22,53.21 v1(141.22,52.45) 141.22,41.66 123.03,23.47 121.54,23.47 121.19,23.11 121.19,21.21 v1(121.19,21.21)
ESP3V3: length 14.6
  Top Layer w0.3: R13.2 138.18,10.54 135.51,10.54 134.08,9.12 126.06,9.12 R14.2
GPIO2: length 18.7
  Top Layer w0.2: v1(37.34,31.5) 37.14,31.3 34.48,31.3 33.98,30.8 U7.4
  Bottom Layer w0.2: v1(37.34,31.5) 45.4,31.5 45.53,31.36 47.69,31.36 47.82,31.5 50.42,31.5 H13.3
GPIO3: length 16.8
  Top Layer w0.2: U7.5 34.39,31.7 36.45,31.7 37.13,32.38 v1(38.23,32.38)
  Bottom Layer w0.2: H13.2 48.77,32.38 48.28,32.38 47.56,31.66 45.65,31.66 44.93,32.38 v1(38.23,32.38)
GPIO4: length 55.2
  Top Layer w0.2: U18.7 60.74,56.01 56.93,52.2 45.85,52.2 42.8,49.15 42.8,44.45 41.4,43.05 41.4,35.18 41.15,34.92 ; 41.15,34.92 44.45,34.92 H13.1 ; 41.15,34.92 39.24,34.92 36.32,32 34.16,32 33.45,31.3 U7.6
  Top Layer w1: U18.7 U21.7
GPIO5: length 44.3
  Top Layer w0.2: H14.5 40.64,39.09 36.78,35.23 36.78,33.85 35.36,32.43 33.98,32.43 33.13,31.58
  Top Layer w1: U19.1 U20.1
  Bottom Layer w0.2: H14.5 44.2,42.29 60.07,42.29 U20.1
GPIO6: length 54.5
  Top Layer w0.2: U7.8 32.92,31.86 33.78,32.73 34.25,32.73 34.58,33.06 34.58,33.18 v1(34.8,33.4) ; v1(28.31,41.66) 28.32,41.66 35.05,48.39 H14.4
  Bottom Layer w0.2: v1(34.8,33.4) 34.8,34.25 28.31,40.74 v1(28.31,41.66) 22,41.66 19.87,39.53 15.65,39.53 15,40.17 14.02,40.17 13.38,40.82 13.38,41.8 7.87,47.3 7.87,47.77 U22.2
GPIO7: length 56.8
  Top Layer w0.2: v1(34.02,33.29) 33.71,33.29 U7.9 ; H14.3 35.43,50.93 27.69,43.18 v1(27.69,40.64)
  Bottom Layer w0.2: v1(34.02,33.29) 34.04,33.31 34.04,33.8 33.09,34.76 33.09,35.53 32.27,36.34 31.98,36.34 v1(27.69,40.64) 27,41.32 22.67,41.32 19.54,38.2 12.11,38.2 9,41.32 9,42.78 8.27,43.5 8.27,45.16 8.07,45.36 U22.1
GPIO8: length 53.6
  Top Layer w0.2: v1(26.67,40.77) 26.67,42.8 37.34,53.47 H14.2 ; U7.11 32.99,33.7 32.99,34.45 v1(32.51,34.92)
  Bottom Layer w0.2: U2.2 8.32,41.81 8.69,41.44 8.69,41.19 11.99,37.9 20.03,37.9 22.9,40.77 v1(26.67,40.77) 31.4,36.04 32.15,36.04 32.51,35.68 v1(32.51,34.92)
GPIO9: length 63.7
  Top Layer w0.2: v1(25.91,40.13) 25.91,43.02 38.9,56.01 H14.1 ; v1(32.43,34.04) 32.37,33.97 32.37,33.64 32.26,33.53 32.25,33.53 U7.12
  Bottom Layer w0.2: U2.1 8.02,39.27 17.57,29.72 22.42,29.72 25.86,33.16 25.86,40.08 v1(25.91,40.13) 26.52,40.13 32.43,34.22 v1(32.43,34.04)
GPIO10: length 101.1
  Top Layer w0.2: H15.5 33.15,51.82 19.56,51.82 19.49,51.75 19.49,45.66 25.68,39.47 31.15,39.47 33.87,36.75 33.87,36.01 v1(33.91,35.96) 32.76,35.96 31.95,35.16 31.95,34.34 31.88,34.27 31.88,33.72 U7.13
  Bottom Layer w0.2: H9.1 79.68,28.15 63.76,28.15 56.72,35.18 34.69,35.18 v1(33.91,35.96)
GPIO11: length 97.3
  Top Layer w0.2: H15.4 31.03,52.24 19.3,52.24 19.19,52.13 19.19,45.45 25.48,39.16 27.62,39.16 30.26,36.52 32.82,36.52 ; 31.15,33.56 31.15,34.86 32.82,36.52 ; 32.82,36.52 v1(33.31,36.52)
  Bottom Layer w0.2: v1(33.31,36.52) 36.3,36.52 37.34,35.48 56.85,35.48 63.88,28.45 H9.2
GPIO12: length 77.5
  Top Layer w0.2: v1(26.42,38.61) 27.21,38.61 27.8,38.02 28.34,38.02 29.64,36.72 29.64,36.18 29.84,35.97 29.84,35.81 29.72,35.69 29.72,34.42 29.34,34.04 29.34,34.03 U7.15 ; v1(12.78,30.95) 12.44,31.29 12.44,50.49 14.49,52.54 27.78,52.54 30.14,54.9 30.17,54.9 30.82,55.55 30.82,55.58 31.24,56.01 H15.3
  Bottom Layer w0.2: v1(26.42,38.61) 26.42,33.29 22.47,29.34 14.39,29.34 v1(12.78,30.95) U5.2
GPIO13: length 75.4
  Top Layer w0.2: H15.2 29.46,56.01 26.3,52.85 14.37,52.85 12.13,50.61 12.13,30.03 v1(13.21,28.96) ; U7.16 28.87,33.93 28.87,34.02 29.34,34.49 29.34,36.32 29.15,36.51 29.15,36.78 28.29,37.64 28.02,37.64 27.94,37.72 v1(27.05,37.72)
  Bottom Layer w0.2: v1(27.05,37.72) 27.05,33.49 22.51,28.96 v1(13.21,28.96) 12.23,28.96 U5.1
GPIO14: length 73.7
  Top Layer w0.2: v1(27.81,37.08) 27.92,36.98 28.52,36.98 28.85,36.65 28.85,36.05 29,35.9 29,34.57 28.57,34.15 28.57,33.67 U7.17 ; v1(13.21,27.88) 11.83,29.26 11.83,50.74 14.24,53.15 24.32,53.15 H15.1
  Bottom Layer w0.2: v1(27.81,37.08) 27.81,36.73 27.74,36.65 27.74,36.25 27.69,36.19 27.69,32.94 24.44,29.69 24.16,29.69 23.65,29.18 23.65,28.9 23.39,28.64 16.45,28.64 15.69,27.88 v1(13.21,27.88) 8.99,27.88 8,28.87 8,29.63
GPIO15: length 70.3
  Top Layer w0.2: 23.62,56.13 20.94,53.45 14.12,53.45 11.53,50.86 11.53,28.37 v1(13.08,26.81) ; v1(28.29,36.42) 28.45,36.27 28.45,35.91 28.7,35.66 28.7,34.7 28.27,34.27 28.27,33.4 U7.18
  Bottom Layer w0.2: 8,27.09 8.28,26.81 v1(13.08,26.81) 15.06,26.81 16.58,28.34 23.69,28.34 23.95,28.6 23.95,29.06 24.28,29.39 25.19,29.39 28.17,32.36 28.17,36.29 v1(28.29,36.42)
GPIO16: length 59.9
  Top Layer w0.2: 21.08,56.13 18.7,53.75 13.99,53.75 11.23,50.99 11.23,26.21 v1(12.32,25.12) ; v1(24.51,28.83) 24.51,29.4 25.71,30.59 25.92,30.59 26.35,30.16 26.41,30.16
  Bottom Layer w0.2: 8,24.42 9.76,24.42 10.45,25.12 v1(12.32,25.12) 13.78,25.12 16.7,28.04 23.95,28.04 24.51,28.6 v1(24.51,28.83)
GPIO17: length 61
  Top Layer w0.2: 18.54,56.13 16.46,54.05 13.87,54.05 10.92,51.11 10.92,23.14 v1(11.58,22.49) ; U7.28 25.78,30.23 25.07,29.51 25.07,28.37 v1(24.77,28.07)
  Bottom Layer w0.2: 8,21.88 10.97,21.88 v1(11.58,22.49) 16.83,27.73 24.43,27.73 v1(24.77,28.07)
GPIO18: length 61.3
  Top Layer w0.2: v1(10.9,20.35) 10.62,20.62 10.62,51.24 13.74,54.36 14.22,54.36 16,56.13 ; v1(24.38,27.18) 24.77,27.18 U7.29
  Bottom Layer w0.2: v1(24.38,27.18) 24.26,27.3 17.19,27.3 10.9,21.01 v1(10.9,20.35) 8.88,18.33 U23.2
GPIO19: length 63.7
  Top Layer w0.2: 13.46,56.13 13.46,54.74 10.32,51.6 v1(10.32,18.38) ; 26.41,28.26 24.57,26.42 v1(24.13,26.42)
  Bottom Layer w0.2: U23.1 8,16.06 v1(10.32,18.38) 10.39,18.38 11.94,19.94 11.94,21.57 13.51,23.13 14.17,23.13 17.46,26.42 v1(24.13,26.42)
GPIO20: length 30.3
  Top Layer w0.2: v1(25.78,26.8) 25.69,26.89 26.7,27.9 U7.31
  Bottom Layer w0.2: v1(25.78,26.8) 25.78,26.51 25.65,26.38 25.65,25.66 17.56,17.56 17.56,13.24 16.89,12.57
  Bottom Layer w0.3: H17.5 13.08,8.76 16.89,12.57 16.89,14.22 15.91,15.2 SW8.1
GPIO21: length 24.3
  Top Layer w0.2: v1(26.32,26.26) 26.32,26.54 26.34,26.56 26.34,27.05 26.98,27.69
  Bottom Layer w0.2: v1(26.32,26.26) 26.16,26.1 26.16,25.74 17.86,17.44 17.86,11.38 15.62,9.14 H17.4
GPIO22: length 23.1
  Top Layer w0.2: v1(26.92,25.78) 27.12,25.98 27.12,26.63 27.55,27.06 U7.34
  Bottom Layer w0.2: H17.3 18.16,17.31 26.63,25.78 v1(26.92,25.78)
GPIO26: length 21.2
  Top Layer w0.2: v1(27.69,24.51) 27.69,24.93 28.68,25.92 U7.38
  Bottom Layer w0.2: v1(27.69,24.51) 26.75,23.57 26.75,14.18 H17.2
GPIO27: length 20
  Top Layer w0.2: U7.39 28.35,25.1 28.35,24.19 28.27,24.1 v1(28.27,23.82)
  Bottom Layer w0.2: v1(28.27,23.82) 28.27,23.46 27.05,22.25 27.05,13.97 23.24,10.16 H17.1
GPIO28: length 18.1
  Top Layer w0.2: U7.40 28.81,25 28.81,24.72 28.91,24.63 v1(28.91,24.26)
  Bottom Layer w0.2: v1(28.91,24.26) 28.91,24.14 28.88,24.11 28.88,23.65 27.43,22.2 H1.5
MAXVDD: length 134.9
  Top Layer w0.2: 114.98,46.01 115.17,46.21 115.71,46.21 115.82,46.1 115.82,42.67 v1(115.06,41.91) 114.29,41.91
  Top Layer w0.3: R28.2 114.98,46.01 113.96,47.03 112.43,47.03 111.86,46.46 C36.2 111.86,42.84 112.14,42.56 ; 112.14,42.56 U16.8 ; 112.14,42.56 U16.7 ; U16.4 114.29,41.91 114.98,42.6 R28.1
  Top Layer w0.5: v1(132.59,19.68) 132.59,18.16 132.08,17.65 Q1.2 ; R21.2 135.9,23.37 R17.1 134.12,25.39 133.48,26.03 ; 133.48,26.03 v1(133.48,25.02) ; 133.48,26.03 129.98,29.52 ; 128.52,26.35 128.42,26.25 U13.1 ; 128.52,26.35 C20.2 ; 128.52,26.35 128.52,28.07 129.98,29.52 ; 129.98,29.52 129.98,33.59 129.29,34.29 U15.2
  Top Layer w1: U1.2 120.29,56.27 ; 120.29,56.27 120.28,56.27 C13.2 ; 120.29,56.27 117.98,56.27 U10.21 117.46,56.78 H12.2 ; v1(121.28,35.94) 122.17,35.05 C30.2 125.98,35.05 126.75,34.29 U15.2
  Bottom Layer w0.2: 119.25,42.45 115.6,42.45 v1(115.06,41.91)
  Bottom Layer w0.5: v1(133.48,25.02) 133.48,20.57 v1(132.59,19.68) ; 119.13,55.12 141.43,55.12 143.9,57.59 144.9,57.59 145.6,56.89 145.6,51.12 H8.3
  Bottom Layer w1: U10.22 U10.21 119.25,54.99 119.25,37.97 v1(121.28,35.94)
NET15: length 1.6
  Top Layer w0.3: L1.2 109.69,41.81 U16.9
NET16: length 2
  Top Layer w0.3: L2.2 110.59,41.06 110.59,41.06 110.84,41.31 U16.10
QSPI_SCLK: length 16.9
  Top Layer w0.2: 37.53,19.51 36.95,18.92 36.44,18.92 35.63,19.73 35.63,21.11 39.67,25.15 39.67,25.93 38.78,26.83 34.28,26.83 U7.52
QSPI_SD0: length 14.7
  Top Layer w0.2: 36.63,20.4 35.93,20.4 35.93,20.98 39.97,25.02 39.97,26.07 38.91,27.13 34.61,27.13 34.05,27.69 U7.53
QSPI_SD1: length 12.2
  Top Layer w0.2: U7.55 35.07,27.73 39.24,27.73 43.05,23.92 43.05,23.23 42.22,22.4
QSPI_SD2: length 10.7
  Top Layer w0.2: 41.33,23.3 41.99,23.97 41.99,24.55 39.12,27.43 34.8,27.43 U7.54
QSPI_SD3: length 18.4
  Top Layer w0.2: U7.51 33.48,27.12 34.08,26.53 38.62,26.53 39.37,25.78 39.37,25.27 35.33,21.23 35.33,19.61 36.9,18.03 37.72,18.03 38.3,18.61 38.43,18.61 38.43,18.61
QSPI_SS: length 15.9
  Top Layer w0.2: 43.16,24.25 43.93,23.48 43.93,22.31 43.12,21.5 ; 43.16,24.25 R9.2 ; 43.16,24.25 39.37,28.04 35.33,28.04 U7.56
RGB_CTRL: length 1.6
  Top Layer w0.5: U13.4 132.49,23.99 R20.2
RTS: length 22.7
  Top Layer w0.3: v1(133.35,27.3) 134.37,26.28 134.37,25.84 134.62,25.59 134.62,24.26 136.14,24.26 R25.2 137.3,25.02 138.04,24.28 140.6,24.28 140.78,24.46 140.78,25.58 140.4,25.96 140.4,26.71 ; v1(126.19,24.46) 125.19,24.46 U14.13
  Bottom Layer w0.3: 126.36,24.64 131.09,24.64 131.19,24.54 131.7,24.54 132.05,24.89 132.05,26.01 v1(133.35,27.3)
RUN: length 21.7
  Top Layer w0.2: SW2.2 SW2.1 21.97,19.31 21.97,24.76 23.57,26.37 23.57,29.29 25.53,31.24 25.91,31.24 26.7,30.45 U7.26
SWCLK: length 17.9
  Top Layer w0.2: 19.56,41.27 18.54,40.26 18.54,37.57 22.48,33.64 22.48,31.62 23.37,30.73 23.88,30.73 25.27,32.13 26.14,32.13 U7.24
SWDIO: length 19.3
  Top Layer w0.2: 26.98,30.73 26.98,30.8 26.55,31.23 26.55,31.3 26.02,31.83 25.4,31.83 24,30.43 23.24,30.43 22.18,31.5 22.18,33.4 14.99,40.59 14.99,40.77 H7.3
USB2_N: length 6.7
  Top Layer w0.3: v1(122.55,22.86) 122.55,23.22 122.54,23.24 122.54,23.77 122.27,24.04 U14.8 ; U11.9 123.11,19.39 v1(122.43,20.07)
  Bottom Layer w0.3: v1(122.55,22.86) 122.55,20.19 v1(122.43,20.07)
USB2_P: length 8
  Top Layer w0.3: U14.7 122.19,24.87 121.77,24.87 121.59,24.69 121.59,24.19 121.79,23.99 v1(121.79,22.86) ; v1(121.76,20.48) 121.82,20.42 121.82,19.81 122.18,19.46 122.4,19.46 122.61,19.25 U11.10
  Bottom Layer w0.3: v1(121.79,22.86) 121.92,22.73 121.92,20.64 v1(121.76,20.48)
USB_DM: length 90.5
  Top Layer w0.2: USBC1.A7 71.75,7.22 71.68,7.29 71.68,7.75 72.2,8.27 72.2,8.72 71.98,8.94 71.98,9.23 v1(71.66,9.55) ; v1(70.79,8.21) 70.79,6.45 USBC1.B7 ; U7.46 32.44,25.27 32.47,25.27 32.89,24.86 32.89,24.66 v1(32.39,24.16) ; SW5.6 v1(100.08,18.09)
  Bottom Layer w0.2: v1(71.66,9.55) 71.33,9.88 71.04,9.88 70.84,10.08 47.24,10.08 33.36,23.96 33.06,23.96 32.85,24.16 v1(32.39,24.16) ; v1(71.66,9.55) 71.66,9.26 71.67,9.24 71.67,8.78 71.35,8.46 71.04,8.46 v1(70.79,8.21) ; v1(71.66,9.55) 72.55,9.55 75.74,12.74 98.98,12.74 100.08,13.84 v1(100.08,18.09)
USB_DP: length 90.7
  Top Layer w0.2: USBC1.B6 72.25,5.75 72.01,5.51 71.5,5.51 71.25,5.75 USBC1.A6 71.25,7.22 71.33,7.29 71.33,7.9 71.84,8.42 71.84,8.57 71.73,8.69 71.44,8.69 v1(71.12,9.01) ; U7.47 32.72,25.56 32.72,25.52 33.52,24.73 33.52,24.53 32.95,23.96 32.95,23.93 32.62,23.61 32.6,23.61 v1(32.39,23.4) ; SW5.3 v1(100.08,12.39)
  Bottom Layer w0.2: v1(100.08,12.39) 75.89,12.39 75.66,12.16 75.66,11.96 75.72,11.91 75.72,11.71 75.64,11.63 75.44,11.63 75.38,11.68 75.18,11.68 75.1,11.6 75.1,11.4 75.15,11.34 75.15,11.14 75.07,11.06 74.87,11.06 74.82,11.12 74.62,11.12 74.53,11.03 74.53,10.83 74.59,10.78 74.59,10.58 74.5,10.5 74.3,10.5 74.25,10.55 74.05,10.55 73.97,10.47 73.97,10.27 74.02,10.21 74.02,10.01 73.94,9.93 73.74,9.93 73.68,9.98 73.48,9.98 71.92,8.41 71.8,8.41 71.49,8.1 71.47,8.1 71.02,7.65 70.56,7.65 70.23,7.97 70.23,8.44 70.56,8.76 70.85,8.76 70.89,8.81 70.91,8.81 v1(71.12,9.01) 70.94,9.01 70.66,9.29 70.66,9.41 70.48,9.58 47.06,9.58 33.08,23.56 32.93,23.56 32.72,23.35 32.44,23.35 v1(32.39,23.4)
V+: length 135.5
  Top Layer w1.5: C3.1 5.46,13.54 U23.4 U23.3 U5.4 U5.3 U2.4 U2.3 U22.4 U22.3 5.46,50.03 C21.1
  Top Layer w2: C15.1 80.53,19.3 D7.1 68.57,19.16 51.94,2.54 12.06,2.54 8.13,6.47 8.13,10.36
VSYS: length 67.4
  Top Layer w0.5: 49.28,26.73 50,26.01 D1.1 ; 49.28,26.73 48.7,26.73 48.33,27.11 U8.1 ; 49.28,26.73 50.56,26.73 ; U8.3 50.23,27.07 50.56,26.73 ; 50.56,26.73 C1.2 51.94,27.5 54.8,30.35 62.99,30.35 v1(63.37,29.97)
  Top Layer w1: U19.7 U20.7 ; H1.1 39.15,8.13 50.55,19.52 50.55,24.22 D1.1
  Bottom Layer w0.5: U19.7 48.01,36.19 57.15,36.19 v1(63.37,29.97)
XI: length 11.5
  Top Layer w0.3: R19.2 131.06,11.77 U12.1 130.24,11.87 C18.1 127.38,12.76 127.38,15.43 126.36,16.45 U11.4
XO: length 21
  Top Layer w0.3: U11.3 126.29,15.95 126.98,15.26 126.98,12.6 127.52,12.06 127.52,11.35 129.3,9.57 131.58,9.57 132.32,10.3 R19.1 134.38,10.3 135.89,11.81 135.89,15.49 R18.2
$1N1870: length 7.3
  Top Layer w0.2: 45.41,18.85 SW1.2 45.41,23.55 44.22,24.74 R9.1
$1N1872: length 9.9
  Top Layer w0.2: U7.21 28.08,31.86 27.66,32.28 27.66,34.52 28.09,34.95 28.09,35.41 27.2,36.3 26.24,36.3 25.24,35.31 24,35.31 23.45,35.85 X1.3
$1N1873: length 7.9
  Top Layer w0.2: 28.39,32.14 28.39,32.18 27.96,32.61 27.96,34.4 28.39,34.82 28.39,35.53 27.33,36.6 26.4,36.6 X1.1
$1N1896: length 2
  Top Layer w0.2: LED2.1 24.07,25.02 24.59,25.02 R7.1
$1N1897: length 2.8
  Top Layer w0.2: R7.2 26.73,24.61 28.39,26.28
$1N2181: length 2.2
  Top Layer w0.2: USBC1.B5 73.25,7.98 73.23,8 R12.2
$1N2182: length 2.5
  Top Layer w0.2: USBC1.A5 70.25,7.95 70.23,7.97 70.23,8.31 R11.2
$1N3810: length 4.8
  Top Layer w0.3: R15.2 R16.1 132.79,16.7 Q1.1
$1N3984: length 8.3
  Top Layer w0.3: Q1.6 129.42,16.7 130.49,17.76 130.49,18.04 130.66,18.22 130.94,18.22 Q1.3
  Top Layer w0.5: Q1.3 131.82,19.1 131.82,19.81 v1(131.83,19.81) ; v1(132.59,21.34) 133.6,21.34 R17.2
  Bottom Layer w0.5: v1(132.59,21.34) 131.83,20.57 v1(131.83,19.81)
$1N4724: length 4.4
  Top Layer w0.3: U12.3 134.72,13.93 C19.1 134.75,15.12 R18.1
$1N5316: length 2.6
  Top Layer w0.5: LED3.1 136.88,21.73 R21.1
$1N6114: length 3.8
  Top Layer w0.3: U14.4 122.84,26.77 121.38,26.77 120.02,25.4 R22.2
$1N6119: length 4.1
  Top Layer w0.3: U14.5 121.12,25.94 120.75,25.57 120.75,24.22 R23.2
$1N6176: length 5.6
  Top Layer w0.3: 122.24,21.59 122.11,21.72 121.79,21.72 121.15,22.36 121.15,25.4 122.23,25.4 U14.6
$1N6413: length 2.3
  Top Layer w0.3: Q3.1 140.07,25.14 R24.1
$1N6452: length 1.8
  Top Layer w0.3: Q2.1 135.39,26.39 R25.1
$1N6986: length 16.5
  Top Layer w0.4: USBC2.B4A9 133.32,6.39 133.32,5.74 132.71,5.13 129.42,5.13 128.81,5.74 128.81,6.39 USBC2.A4B9
  Top Layer w0.5: USBC2.A4B9 128.66,7.76 129.41,8.51 135.92,8.51 D3.2
$1N7041: length 3.6
  Top Layer w0.3: 127.69,8.25 127.94,8.51 v1(128.4,8.51) ; v1(129.63,7.64) 129.63,7.45 129.81,7.26 USBC2.A5
  Bottom Layer w0.3: v1(129.63,7.64) 128.76,8.51 v1(128.4,8.51)
$1N7109: length 4.6
  Top Layer w0.3: R27.2 133.77,7.49 133.77,7.49 133.04,7.49 132.86,7.31 132.86,6.59 USBC2.B5
$1N7689: length 1.7
  Top Layer w0.5: R8.1 46.48,26.75 LED1.2
$1N13425: length 18.3
  Top Layer w0.3: L1.1 109.64,44.93
  Top Layer w0.5: v1(108.37,37.63) 105.44,34.7 U17.2 ; 109.64,44.93 109.04,45.53 109.02,45.53 107.98,46.57 107.98,46.97 107.75,47.21 107.37,47.21 106.92,47.65 CN1.1 ; v1(108.37,39.92) 108.37,41.89 L1.1
  Bottom Layer w0.5: v1(108.37,39.92) v1(108.37,37.63)
$1N13429: length 16
  Top Layer w0.3: L2.1 109.64,36.93
  Top Layer w0.5: CN1.2 106.48,42.51 U17.1 104.67,38.71 L2.1
$1N14871: length 2.9
  Top Layer w1: U19.2 U20.2
$1N14876: length 2.9
  Top Layer w1: 56.64,37.72 56.64,40.64
$1N14881: length 2.9
  Top Layer w1: U19.4 U20.4
$1N14886: length 2.9
  Top Layer w1: U19.5 U20.5
$1N14907: length 2.9
  Top Layer w1: U18.1 U21.1
$1N14912: length 2.9
  Top Layer w1: U21.2 U18.2
$1N14917: length 2.9
  Top Layer w1: U18.3 U21.3
$1N14922: length 2.9
  Top Layer w1: U21.4 U18.4
$1N14927: length 2.9
  Top Layer w1: 56.64,56.01 56.64,58.93
$1N14932: length 2.9
  Top Layer w1: U21.6 U18.6
$1N15236: length 2
  Top Layer w0.2: R30.2 105.74,6.92 105.73,6.91 105.73,6.25 USBC3.B5
$1N15239: length 29.1
  Top Layer w0.4: USBC3.B4A9 106.29,5.7 106.14,5.55 106.14,5.36 105.93,5.16 105.74,5.16 105.41,4.83 104.53,4.83 104.51,4.81 102.19,4.81 101.63,5.36 101.63,6.01 USBC3.A4B9
  Top Layer w0.5: 100.84,7.21 99.56,7.21 98.56,6.2 98.56,4.57 99.15,3.99 108.63,3.99 110.8,6.16 111.6,6.16 D5.2 ; 100.84,7.21 101.15,7.21 101.49,6.88 USBC3.A4B9 ; 100.84,7.21 100.23,7.82 100.23,7.88 D4.2
$1N15244: length 2.6
  Top Layer w0.2: USBC3.A5 102.64,6.97 102.52,7.08 102.52,8.02 102.29,8.25 101.96,8.25
$1N16557: length 50.6
  Top Layer w0.5: U25.1 87.54,4.36 89.25,6.07 96.21,6.07 98.9,3.38 110.27,3.38 112.95,6.07 113.54,6.07 ; D6.2 80.39,11.15
  Top Layer w1.5: 82.28,2.65 83.69,4.06 U25.1 ; 82.28,2.65 82.28,3.32 81.88,3.72 81.88,9.56 80.39,11.05 D7.2 ; 82.28,2.65 U3.1

## Copper pours and planes (outline as drawn; the poured copper is in the pictures)
3V3 on Top Layer: 34.4,30.13 36.23,30.13 36.23,28.73 34.4,28.73
GND on Top Layer: -5.21,69.34 153.16,69.34 153.16,-1.02 -5.21,-1.02
GND on Bottom Layer: -4.32,69.47 152.78,69.47 152.78,-2.79 -4.32,-2.79

Small or netless copper shapes (teardrops, artwork), in the pictures only: 1 on Top Layer

## Text on the board
